# Altium schematic sheet 6-CONFIG.SchDoc
size A4; DocumentNumber: 6; SheetNumber: 6; SheetTotal: 7
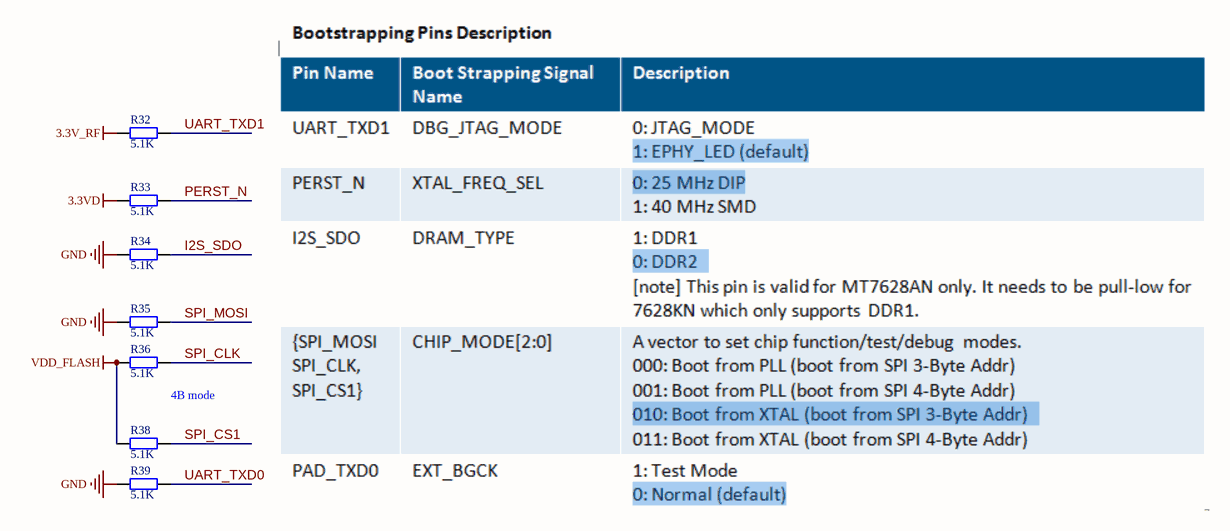
[diagram p0: 6-CONFIG.SchDoc]

## Parts
R32  5.1K  [R0402]
R33  5.1K  [R0402]
R34  5.1K  [R0402]
R35  5.1K  [R0402]
R36  5.1K  [R0402]
R38  5.1K  [R0402]
R39  5.1K  [R0402]

## Nets
3.3V_RF: R32.1
3.3VD: R33.1
GND: R34.1 R35.1 R39.1
VDD_FLASH: R36.1 R38.1
I2S_SDO: R34.2
PERST_N: R33.2
SPI_CLK: R36.2
SPI_CS1: R38.2
SPI_MOSI: R35.2
UART_TXD0: R39.2
UART_TXD1: R32.2

## Notes on the sheet
- 4B mode

## Library data of the parts
R32-R36 R38 R39 = RES: 普通电阻